# Altium schematic sheet 03_Peripheral.SchDoc
size A4; SheetNumber: 4; SheetTotal: 4
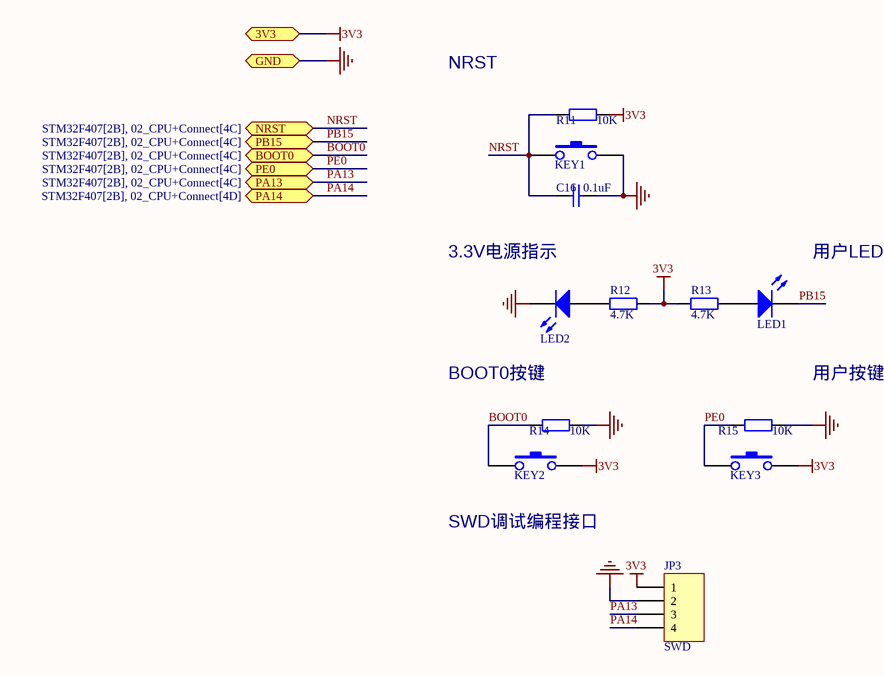
[diagram p0: 03_Peripheral.SchDoc]

## Parts
C16  0.1uF  [C 0402_L]
JP3  SWD  [HDR2.54-WS-4P]
KEY1  KEY  [SWT3*4]  (value not drawn)
KEY2  KEY  [SWT3*4]  (value not drawn)
KEY3  KEY  [SWT3*4]  (value not drawn)
LED1  LED  [LED 0603]  (value not drawn)
LED2  LED  [LED 0603]  (value not drawn)
R11  10K  [R 0402_L]
R12  4.7K  [R 0402_L]
R13  4.7K  [R 0402_L]
R14  10K  [R 0402_L]
R15  10K  [R 0402_L]

## Ports
3V3 (bidir, see STM32F407[1B], 01_Power[1A], 02_CPU+Connect[3C], 02_CPU+Connect[4C]), BOOT0 (bidir, see STM32F407[2B], 02_CPU+Connect[4C]), GND (bidir, see STM32F407[1B], 01_Power[1A], 02_CPU+Connect[3C], 02_CPU+Connect[4C]), NRST (bidir, see STM32F407[2B], 02_CPU+Connect[4C]), PA13 (bidir, see STM32F407[2B], 02_CPU+Connect[4C]), PA14 (bidir, see STM32F407[2B], 02_CPU+Connect[4D]), PB15 (bidir, see STM32F407[2B], 02_CPU+Connect[4C]), PE0 (bidir, see STM32F407[2B], 02_CPU+Connect[4C])

## Nets
3V3: JP3.1 KEY2.2 KEY3.2 R11.1 R12.1 R13.1 ; port 3V3
GND: C16.1 JP3.2 KEY1.2 LED2.2(K) R14.1 R15.1 ; port GND
BOOT0: KEY2.1 R14.2 ; port BOOT0
NRST: C16.2 KEY1.1 R11.2 ; port NRST
PA13: JP3.3 ; port PA13
PA14: JP3.4 ; port PA14
PB15: LED1.2(K) ; port PB15
PE0: KEY3.1 R15.2 ; port PE0
NetLED1_1: LED1.1(A) R13.2
NetLED2_1: LED2.1(A) R12.2

## Notes on the sheet
- NRST
- 3.3V电源指示
- 用户LED
- BOOT0按键
- 用户按键
- (near KEY2) SWD调试编程接口

## Library data of the parts
C16 = Cap
JP3 = Header 1*4: LatestRevisionDate: 17-Jul-2002; LatestRevisionNote: Re-released for DXP Platform.; Publisher: Altium Limited
R11-R15 = Res